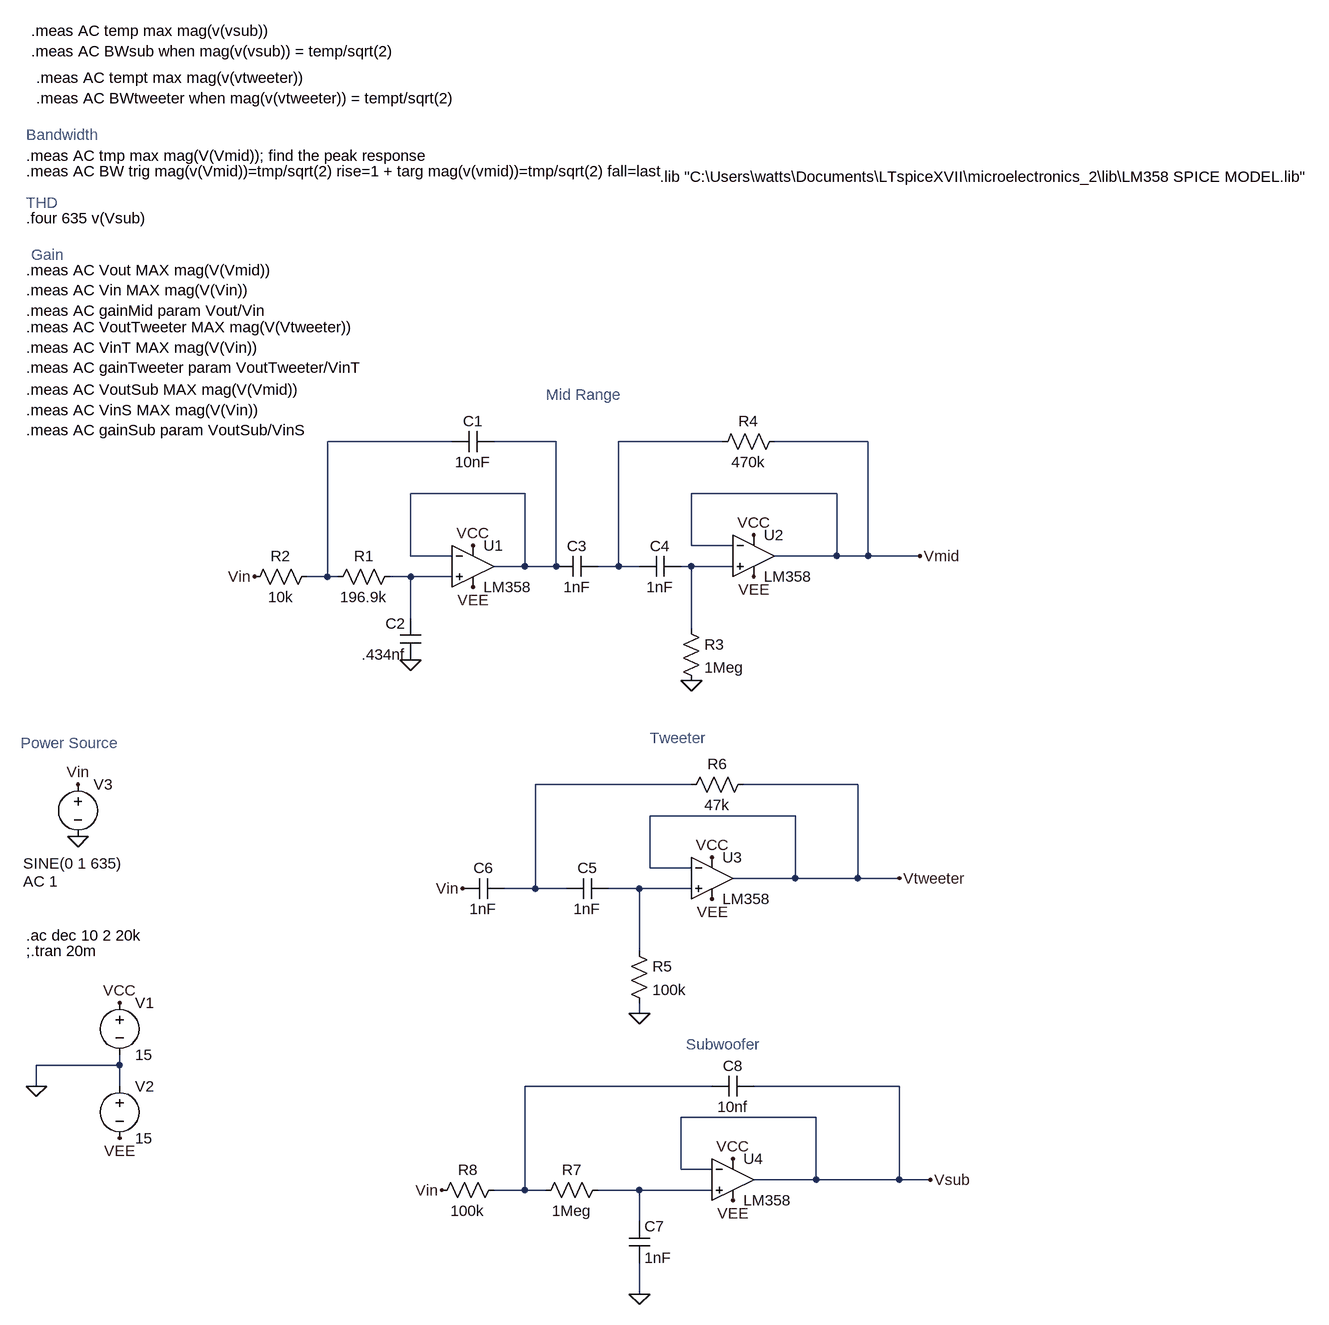
[diagram p0: schematic active_filters.asc]
active_filters.asc, the LTspice schematic file:
Version 4
SHEET 1 1256 1076
WIRE -176 -256 -368 -256
WIRE -16 -256 -112 -256
WIRE 240 -256 80 -256
WIRE 464 -256 320 -256
WIRE -64 -176 -240 -176
WIRE 416 -176 192 -176
WIRE 192 -96 192 -176
WIRE 256 -96 192 -96
WIRE -240 -80 -240 -176
WIRE -176 -80 -240 -80
WIRE 416 -80 416 -176
WIRE 416 -80 320 -80
WIRE 464 -80 464 -256
WIRE 464 -80 416 -80
WIRE 544 -80 464 -80
WIRE -64 -64 -64 -176
WIRE -64 -64 -112 -64
WIRE -16 -64 -16 -256
WIRE -16 -64 -64 -64
WIRE 80 -64 80 -256
WIRE 80 -64 48 -64
WIRE 112 -64 80 -64
WIRE 192 -64 176 -64
WIRE 256 -64 192 -64
WIRE -368 -48 -368 -256
WIRE -368 -48 -400 -48
WIRE -352 -48 -368 -48
WIRE -240 -48 -272 -48
WIRE -176 -48 -240 -48
WIRE -240 16 -240 -48
WIRE 192 32 192 -64
WIRE 192 272 -48 272
WIRE 448 272 272 272
WIRE 352 320 128 320
WIRE 128 400 128 320
WIRE 192 400 128 400
WIRE 352 416 352 320
WIRE 352 416 256 416
WIRE 448 416 448 272
WIRE 448 416 352 416
WIRE 512 416 448 416
WIRE -48 432 -48 272
WIRE -48 432 -96 432
WIRE 0 432 -48 432
WIRE 112 432 64 432
WIRE 192 432 112 432
WIRE 112 528 112 432
WIRE 112 624 112 608
WIRE -688 704 -688 688
WIRE -688 704 -816 704
WIRE -816 736 -816 704
WIRE -688 736 -688 704
WIRE 224 736 -64 736
WIRE 512 736 288 736
WIRE 384 784 176 784
WIRE 176 864 176 784
WIRE 224 864 176 864
WIRE 384 880 384 784
WIRE 384 880 288 880
WIRE 512 880 512 736
WIRE 512 880 384 880
WIRE 560 880 512 880
WIRE -64 896 -64 736
WIRE -64 896 -112 896
WIRE -32 896 -64 896
WIRE 112 896 48 896
WIRE 224 896 112 896
WIRE 112 944 112 896
WIRE 112 1056 112 1008
FLAG -144 -32 VEE
FLAG -144 -96 VCC
FLAG -816 736 0
FLAG -688 608 VCC
FLAG -688 816 VEE
FLAG 288 -48 VEE
FLAG 288 -112 VCC
FLAG -240 80 0
FLAG -480 -48 Vin
FLAG 192 112 0
FLAG 544 -80 Vmid
FLAG -752 352 0
FLAG -752 272 Vin
FLAG 224 448 VEE
FLAG 224 384 VCC
FLAG 112 624 0
FLAG -160 432 Vin
FLAG 512 416 Vtweeter
FLAG 256 912 VEE
FLAG 256 848 VCC
FLAG 112 1056 0
FLAG 560 880 Vsub
FLAG -192 896 Vin
SYMBOL OpAmps\\opamp2 -144 -128 R0
SYMATTR InstName U1
SYMATTR Value LM358
SYMBOL voltage -688 592 R0
WINDOW 123 0 0 Left 0
WINDOW 39 0 0 Left 0
SYMATTR InstName V1
SYMATTR Value 15
SYMBOL voltage -688 720 R0
WINDOW 123 0 0 Left 0
WINDOW 39 0 0 Left 0
SYMATTR InstName V2
SYMATTR Value 15
SYMBOL OpAmps\\opamp2 288 -144 R0
SYMATTR InstName U2
SYMATTR Value LM358
SYMBOL cap -112 -272 R90
WINDOW 0 0 32 VBottom 2
WINDOW 3 32 32 VTop 2
SYMATTR InstName C1
SYMATTR Value 10nF
SYMBOL cap -224 80 R180
WINDOW 0 24 56 Left 2
WINDOW 3 24 8 Left 2
SYMATTR InstName C2
SYMATTR Value .434nf
SYMBOL cap -16 -48 R270
WINDOW 0 32 32 VTop 2
WINDOW 3 0 32 VBottom 2
SYMATTR InstName C3
SYMATTR Value 1nF
SYMBOL res -256 -64 R90
WINDOW 0 0 56 VBottom 2
WINDOW 3 32 56 VTop 2
SYMATTR InstName R1
SYMATTR Value 196.9k
SYMBOL res -384 -64 R90
WINDOW 0 0 56 VBottom 2
WINDOW 3 32 56 VTop 2
SYMATTR InstName R2
SYMATTR Value 10k
SYMBOL cap 176 -80 R90
WINDOW 0 0 32 VBottom 2
WINDOW 3 32 32 VTop 2
SYMATTR InstName C4
SYMATTR Value 1nF
SYMBOL res 176 16 R0
SYMATTR InstName R3
SYMATTR Value 1Meg
SYMBOL res 336 -272 R90
WINDOW 0 0 56 VBottom 2
WINDOW 3 32 56 VTop 2
SYMATTR InstName R4
SYMATTR Value 470k
SYMBOL voltage -752 256 R0
WINDOW 3 -84 137 Left 2
WINDOW 123 -84 165 Left 2
WINDOW 39 0 0 Left 0
SYMATTR Value SINE(0 1 635)
SYMATTR Value2 AC 1
SYMATTR InstName V3
SYMBOL OpAmps\\opamp2 224 352 R0
SYMATTR InstName U3
SYMATTR Value LM358
SYMBOL cap 64 416 R90
WINDOW 0 0 32 VBottom 2
WINDOW 3 32 32 VTop 2
SYMATTR InstName C5
SYMATTR Value 1nF
SYMBOL cap -96 416 R90
WINDOW 0 0 32 VBottom 2
WINDOW 3 32 32 VTop 2
SYMATTR InstName C6
SYMATTR Value 1nF
SYMBOL res 96 512 R0
SYMATTR InstName R5
SYMATTR Value 100k
SYMBOL res 288 256 R90
WINDOW 0 0 56 VBottom 2
WINDOW 3 32 56 VTop 2
SYMATTR InstName R6
SYMATTR Value 47k
SYMBOL OpAmps\\opamp2 256 816 R0
SYMATTR InstName U4
SYMATTR Value LM358
SYMBOL cap 96 944 R0
SYMATTR InstName C7
SYMATTR Value 1nF
SYMBOL res 64 880 R90
WINDOW 0 0 56 VBottom 2
WINDOW 3 32 56 VTop 2
SYMATTR InstName R7
SYMATTR Value 1Meg
SYMBOL res -96 880 R90
WINDOW 0 0 56 VBottom 2
WINDOW 3 32 56 VTop 2
SYMATTR InstName R8
SYMATTR Value 100k
SYMBOL cap 288 720 R90
WINDOW 0 0 32 VBottom 2
WINDOW 3 32 32 VTop 2
SYMATTR InstName C8
SYMATTR Value 10nf
TEXT 144 -664 Left 2 !.lib "C:\\Users\\watts\\Documents\\LTspiceXVII\\microelectronics_2\\lib\\LM358 SPICE MODEL.lib"
TEXT -832 528 Left 2 !;.tran 20m
TEXT -832 504 Left 2 !.ac dec 10 2 20k
TEXT -832 -520 Left 2 !.meas AC Vout MAX mag(V(Vmid))\n.meas AC Vin MAX mag(V(Vin))\n.meas AC gainMid param Vout/Vin
TEXT -832 -696 Left 2 !.meas AC tmp max mag(V(Vmid)); find the peak response
TEXT -832 -672 Left 2 !.meas AC BW trig mag(v(Vmid))=tmp/sqrt(2) rise=1 + targ mag(v(vmid))=tmp/sqrt(2) fall=last
TEXT -832 -728 Left 2 ;Bandwidth
TEXT -832 -600 Left 2 !.four 635 v(Vsub)
TEXT -832 -624 Left 2 ;THD
TEXT -824 -544 Left 2 ;Gain
TEXT -840 208 Left 2 ;Power Source
TEXT -32 -328 Left 2 ;Mid Range
TEXT 128 200 Left 2 ;Tweeter
TEXT 184 672 Left 2 ;Subwoofer
TEXT -832 -432 Left 2 !.meas AC VoutTweeter MAX mag(V(Vtweeter))\n.meas AC VinT MAX mag(V(Vin))\n.meas AC gainTweeter param VoutTweeter/VinT
TEXT -832 -336 Left 2 !.meas AC VoutSub MAX mag(V(Vmid))\n.meas AC VinS MAX mag(V(Vin))\n.meas AC gainSub param VoutSub/VinS
TEXT -824 -888 Left 2 !.meas AC temp max mag(v(vsub))\n.meas AC BWsub when mag(v(vsub)) = temp/sqrt(2)
TEXT -816 -816 Left 2 !.meas AC tempt max mag(v(vtweeter))\n.meas AC BWtweeter when mag(v(vtweeter)) = tempt/sqrt(2)

The netlist it stands for:
* active_filters.asc
XU1 N005 N002 VCC VEE N002 LM358  ; pins In+ In- V+ V- OUT
V1 VCC 0 15
V2 0 VEE 15
XU2 N004 Vmid VCC VEE Vmid LM358  ; pins In+ In- V+ V- OUT
C1 N002 N001 10nF
C2 0 N005 .434nf
C3 N002 N003 1nF
R1 N005 N001 196.9k
R2 N001 Vin 10k
C4 N004 N003 1nF
R3 N004 0 1Meg
R4 Vmid N003 470k
V3 Vin 0 SINE(0 1 635) AC 1
XU3 N007 Vtweeter VCC VEE Vtweeter LM358  ; pins In+ In- V+ V- OUT
C5 N007 N006 1nF
C6 N006 Vin 1nF
R5 N007 0 100k
R6 Vtweeter N006 47k
XU4 N009 Vsub VCC VEE Vsub LM358  ; pins In+ In- V+ V- OUT
C7 N009 0 1nF
R7 N009 N008 1Meg
R8 N008 Vin 100k
C8 Vsub N008 10nf
.lib "C:\Users\watts\Documents\LTspiceXVII\microelectronics_2\lib\LM358 SPICE MODEL.lib"
;.tran 20m
.ac dec 10 2 20k
.meas AC Vout MAX mag(V(Vmid))
.meas AC Vin MAX mag(V(Vin))
.meas AC gainMid param Vout/Vin
.meas AC tmp max mag(V(Vmid)); find the peak response
.meas AC BW trig mag(v(Vmid))=tmp/sqrt(2) rise=1 + targ mag(v(vmid))=tmp/sqrt(2) fall=last
* Bandwidth
.four 635 v(Vsub)
* THD
* Gain
* Power Source
* Mid Range
* Tweeter
* Subwoofer
.meas AC VoutTweeter MAX mag(V(Vtweeter))
.meas AC VinT MAX mag(V(Vin))
.meas AC gainTweeter param VoutTweeter/VinT
.meas AC VoutSub MAX mag(V(Vmid))
.meas AC VinS MAX mag(V(Vin))
.meas AC gainSub param VoutSub/VinS
.meas AC temp max mag(v(vsub))
.meas AC BWsub when mag(v(vsub)) = temp/sqrt(2)
.meas AC tempt max mag(v(vtweeter))
.meas AC BWtweeter when mag(v(vtweeter)) = tempt/sqrt(2)
.backanno
.end